# EasyEDA schematic STM Addon v1.1.json
TITLE: STM32 Addon Board (Epimetheus); REV: 1.1; Date: 20-01-2024; Sheet: 1/1; Drawn By: NeMesiS; Company: XeniumMods
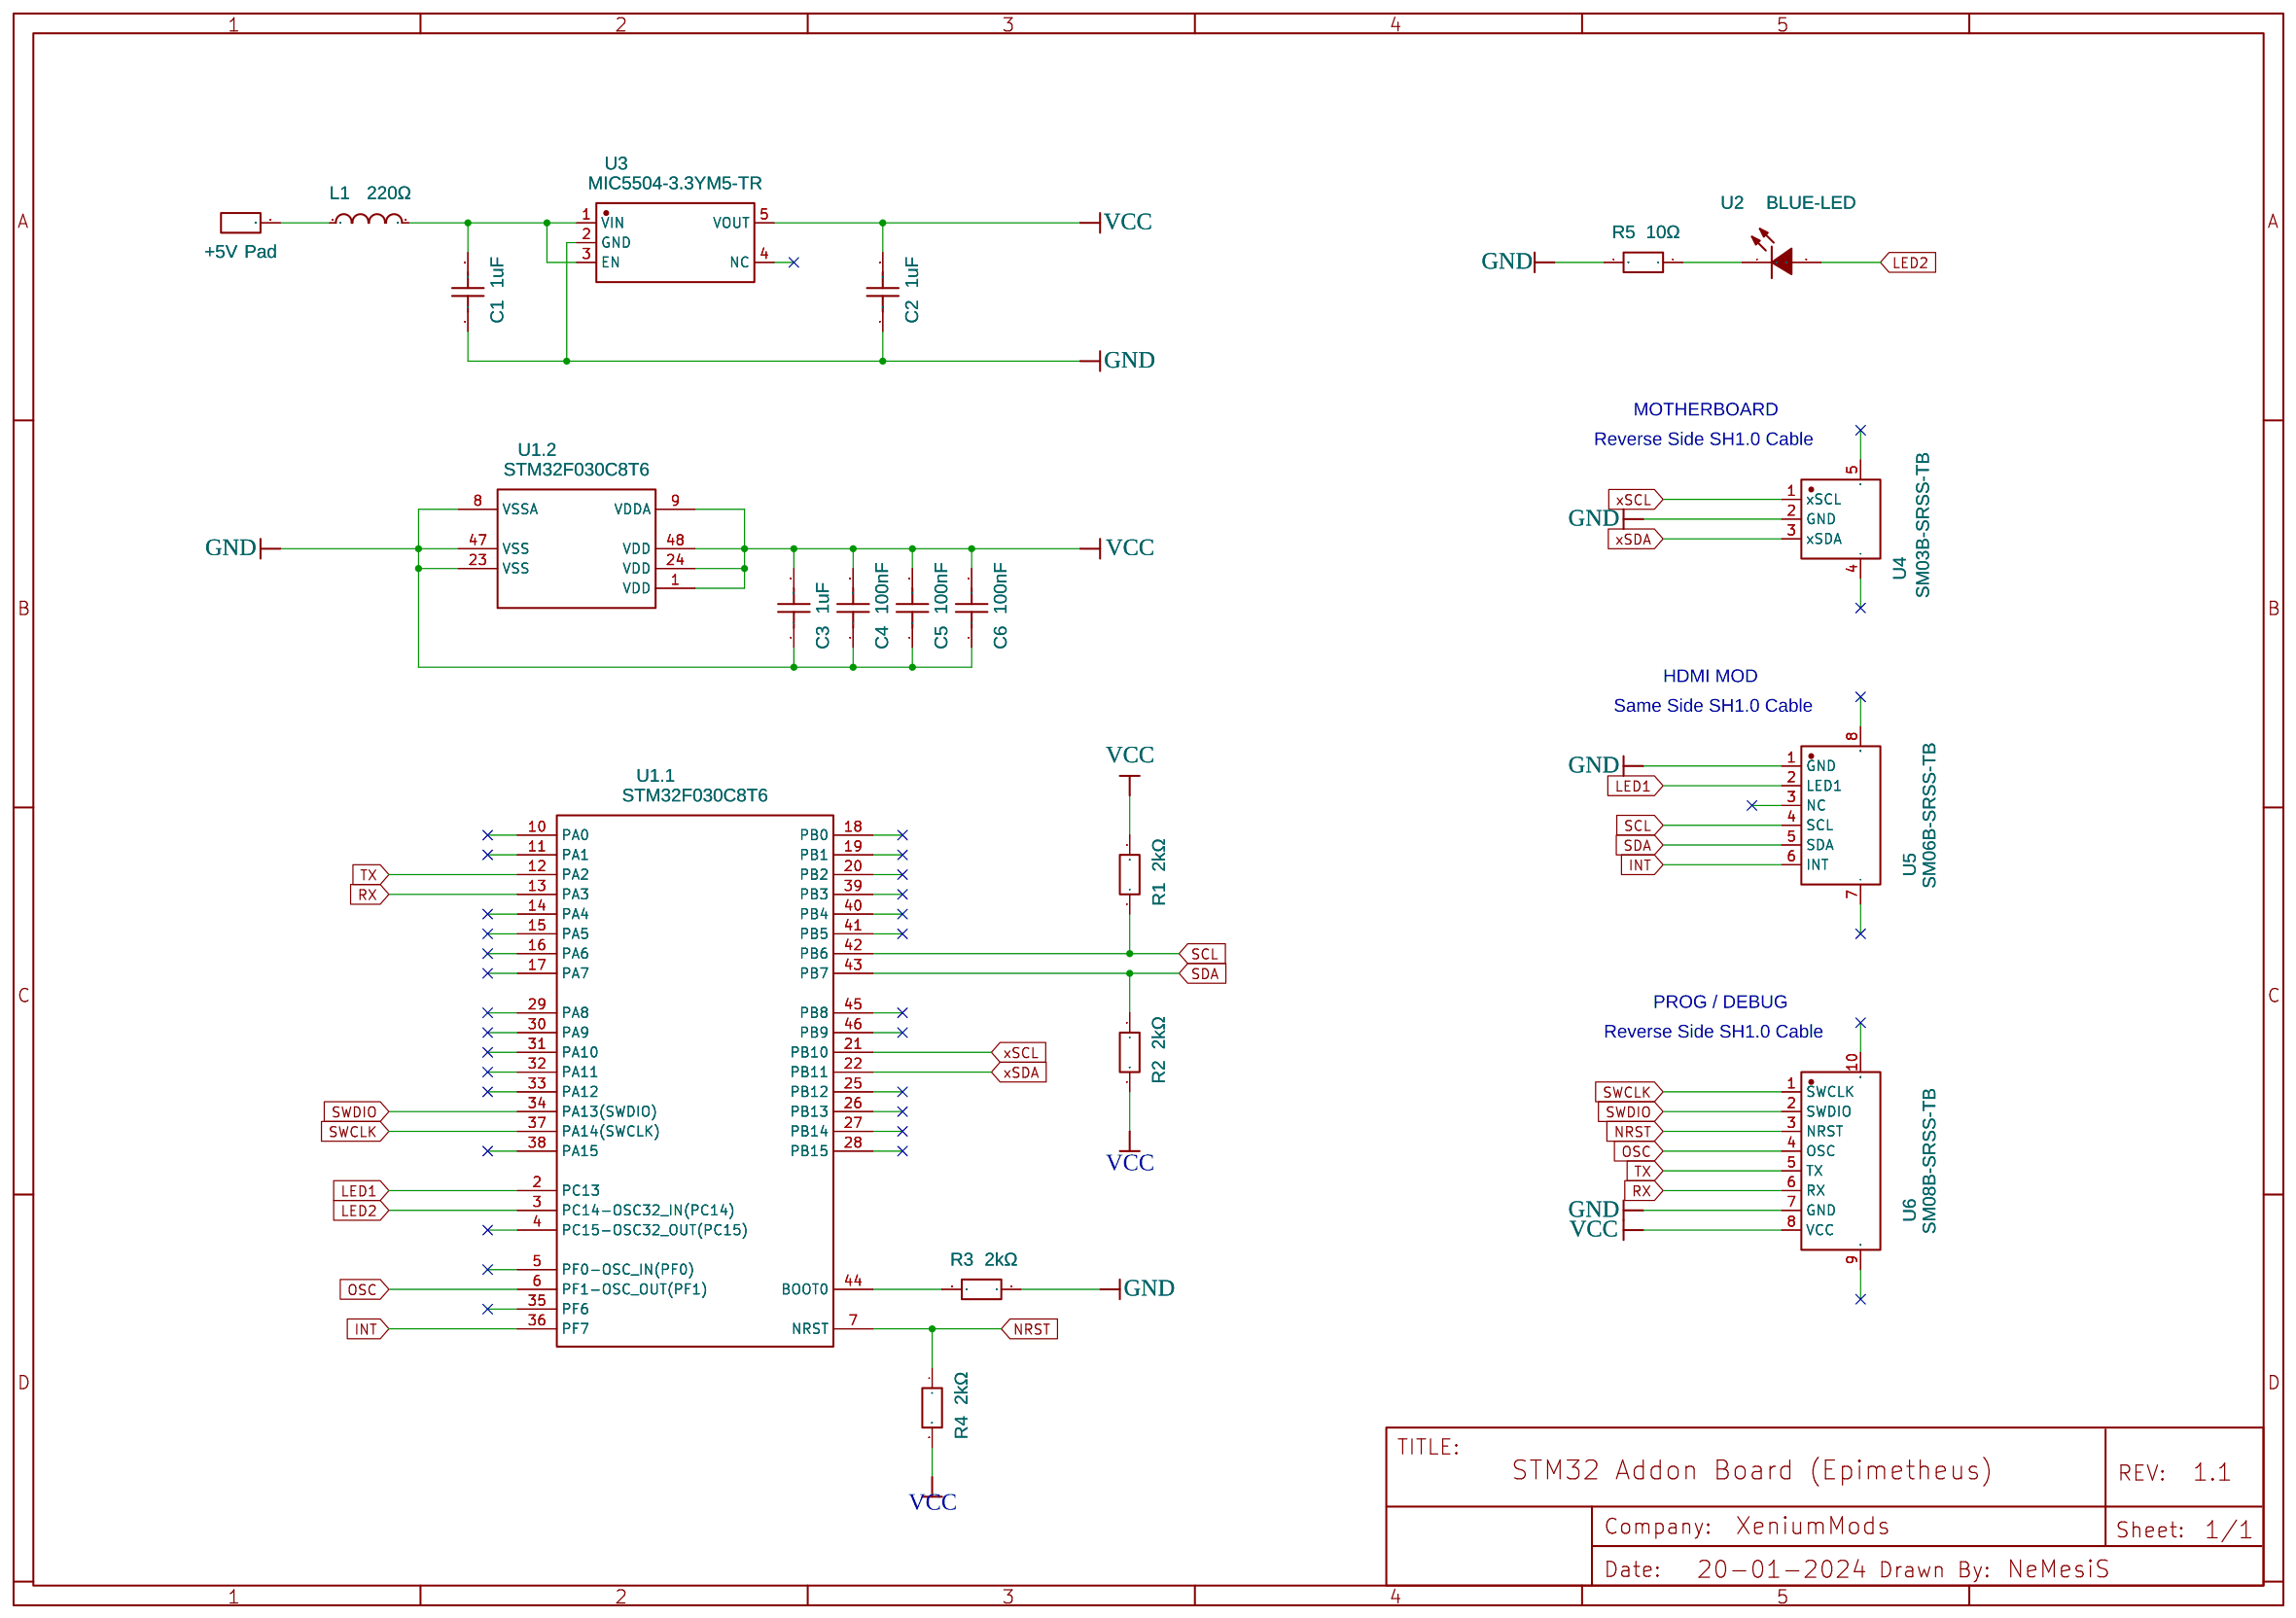
[diagram p0: schematic sheet]

## Parts
+5V  Pad  [HDR-M-2.54_1X1]
C1  1uF  [C0805]
C2  1uF  [C0805]
C3  1uF  [C0805]
C4  100nF  [C0805]
C5  100nF  [C0805]
C6  100nF  [C0805]
L1  220Ω  [L0805]
R1  2kΩ  [R0805]
R2  2kΩ  [R0805]
R3  2kΩ  [R0805]
R4  2kΩ  [R0805]
R5  10Ω  [R0805]
U1  STM32F030C8T6  [LQFP-48_L7.0-W7.0-P0.50-LS9.0-BL]  (sections 1,2)
U2  BLUE-LED  [LED0805-RD_BLUE]
U3  MIC5504-3.3YM5-TR  [SOT-23-5_L3.0-W1.7-P0.95-LS2.8-TL]
U4  SM03B-SRSS-TB  [CONN-SMD_SM03B-SRSS-TB-LF-SN-P]
U5  SM06B-SRSS-TB  [CONN-SMD_SM06B-SRSS-TB-LF-SN]
U6  SM08B-SRSS-TB  [CONN-TH_SM08B-SRSS-TB-LF-SN]

## Library data of the parts
+5V = HDR-M-2.54_1x1: Supplier Part: C81276; Supplier: LCSC; Contributor: LCEDA_Lib
C1-C3 = C0805C104K5RACTU_C3018562: Contributor: lcsc; Supplier: LCSC; Supplier Part: C3018567; Manufacturer: KEMET(基美); Manufacturer Part: C0805C105K5RACTU; JLCPCB Part Class: Extended Part
C4-C6 = C0805C104K5RACTU_C3018562: Contributor: lcsc; Supplier: LCSC; Supplier Part: C3018562; Manufacturer: KEMET(基美); Manufacturer Part: C0805C104K5RACTU; JLCPCB Part Class: Extended Part
L1 = MPZ2012S221AT000: Supplier: LCSC; Manufacturer: TDK; Supplier Part: C76818; JLCPCB Part Class: Extended Part
R1-R4 = CRCW08052K00FKEA: Contributor: LCSC; Supplier: LCSC; Supplier Part: C844834; Manufacturer: VISHAY(威世); JLCPCB Part Class: Extended Part
R5 = CRCW080510R0FKEA: Contributor: LCSC; Supplier: LCSC; Supplier Part: C844938; Manufacturer: VISHAY(威世); JLCPCB Part Class: Extended Part
U1 = STM32F030C8T6: tags: STM32; Supplier Part: C23922; Supplier: LCSC; Manufacturer: ST(意法半导体); subpart_no: 1; image: http://image.lceda.cn/szlcsc/C23922.jpg; JLCPCB Part Class: Basic Part
U2 = LTST-C170TBKT: Contributor: LCSC; Supplier: LCSC; Manufacturer: LITEON(光宝); Supplier Part: C98222; JLCPCB Part Class: Extended Part
U3 = MIC5504-3.3YM5-TR: Contributor: LCSC; Supplier: LCSC; Manufacturer: MICROCHIP(美国微芯); Supplier Part: C88419; JLCPCB Part Class: Extended Part
U4 = SM03B-SRSS-TB(LF)(SN)(P): Contributor: LCSC; Supplier: LCSC; Supplier Part: C160403; Manufacturer: JST; Manufacturer Part: SM03B-SRSS-TB(LF)(SN); JLCPCB Part Class: Extended Part
U5 = SM06B-SRSS-TB(LF)(SN): Contributor: LCSC; Supplier: LCSC; Supplier Part: C160405; Manufacturer: JST; JLCPCB Part Class: Extended Part
U6 = SM08B-SRSS-TB(LF)(SN): Contributor: LCSC; Supplier: LCSC; Supplier Part: C160407; Manufacturer: JST; JLCPCB Part Class: Extended Part

## Nets
GND: C1.1 C2.1 C3.1 C4.1 C5.1 C6.1 R3.2 R5.2 U1.8(VSSA) U1.23(VSS) U1.47(VSS) U3.2(GND) U4.2(GND) U5.1(GND) U6.7(GND)
VCC: C2.2 C3.2 C4.2 C5.2 C6.2 R1.2 R2.2 R4.2 U1.1(VDD) U1.9(VDDA) U1.24(VDD) U1.48(VDD) U3.5(VOUT) U6.8(VCC)
INT: U1.36(PF7) U5.6(INT)
LED1: U1.2(PC13) U5.2(LED1)
LED2: U1.3(PC14-OSC32_IN(PC14)) U2.2(A)
NRST: R4.1 U1.7(NRST) U6.3(NRST)
OSC: U1.6(PF1-OSC_OUT(PF1)) U6.4(OSC)
RX: U1.13(PA3) U6.6(RX)
SCL: R1.1 U1.42(PB6) U5.4(SCL)
SDA: R2.1 U1.43(PB7) U5.5(SDA)
SWCLK: U1.37(PA14(SWCLK)) U6.1(SWCLK)
SWDIO: U1.34(PA13(SWDIO)) U6.2(SWDIO)
TX: U1.12(PA2) U6.5(TX)
xSCL: U1.21(PB10) U4.1(xSCL)
xSDA: U1.22(PB11) U4.3(xSDA)
Net-(+5V-1): +5V.1(Pad) L1.1
Net-(C1-2): C1.2 L1.2 U3.1(VIN) U3.3(EN)
Net-(R3-1): R3.1 U1.44(BOOT0)
Net-(R5-1): R5.1 U2.1(K)

Not connected (* = marked no-connect by the designer): U1 4(PC15-OSC32_OUT(PC15)) 5(PF0-OSC_IN(PF0)) 10(PA0) 11(PA1) 14(PA4) 15(PA5) 16(PA6) 17(PA7) 18(PB0) 19(PB1) 20(PB2) 25(PB12) 26(PB13) 27(PB14) 28(PB15) 29(PA8) 30(PA9) 31(PA10) 32(PA11) 33(PA12) 35(PF6) 38(PA15) 39(PB3) 40(PB4) 41(PB5) 45(PB8) 46(PB9); U3 4(NC); U4 4 5; U5 3(NC) 7 8; U6 9 10

## Notes on the sheet
- MOTHERBOARD
- Reverse Side SH1.0 Cable
- HDMI MOD
- Same Side SH1.0 Cable
- PROG / DEBUG
- Reverse Side SH1.0 Cable
